# EAGLE design digital (EAGLE 6.6.0)

## Sheet 1 of 5: FPGA
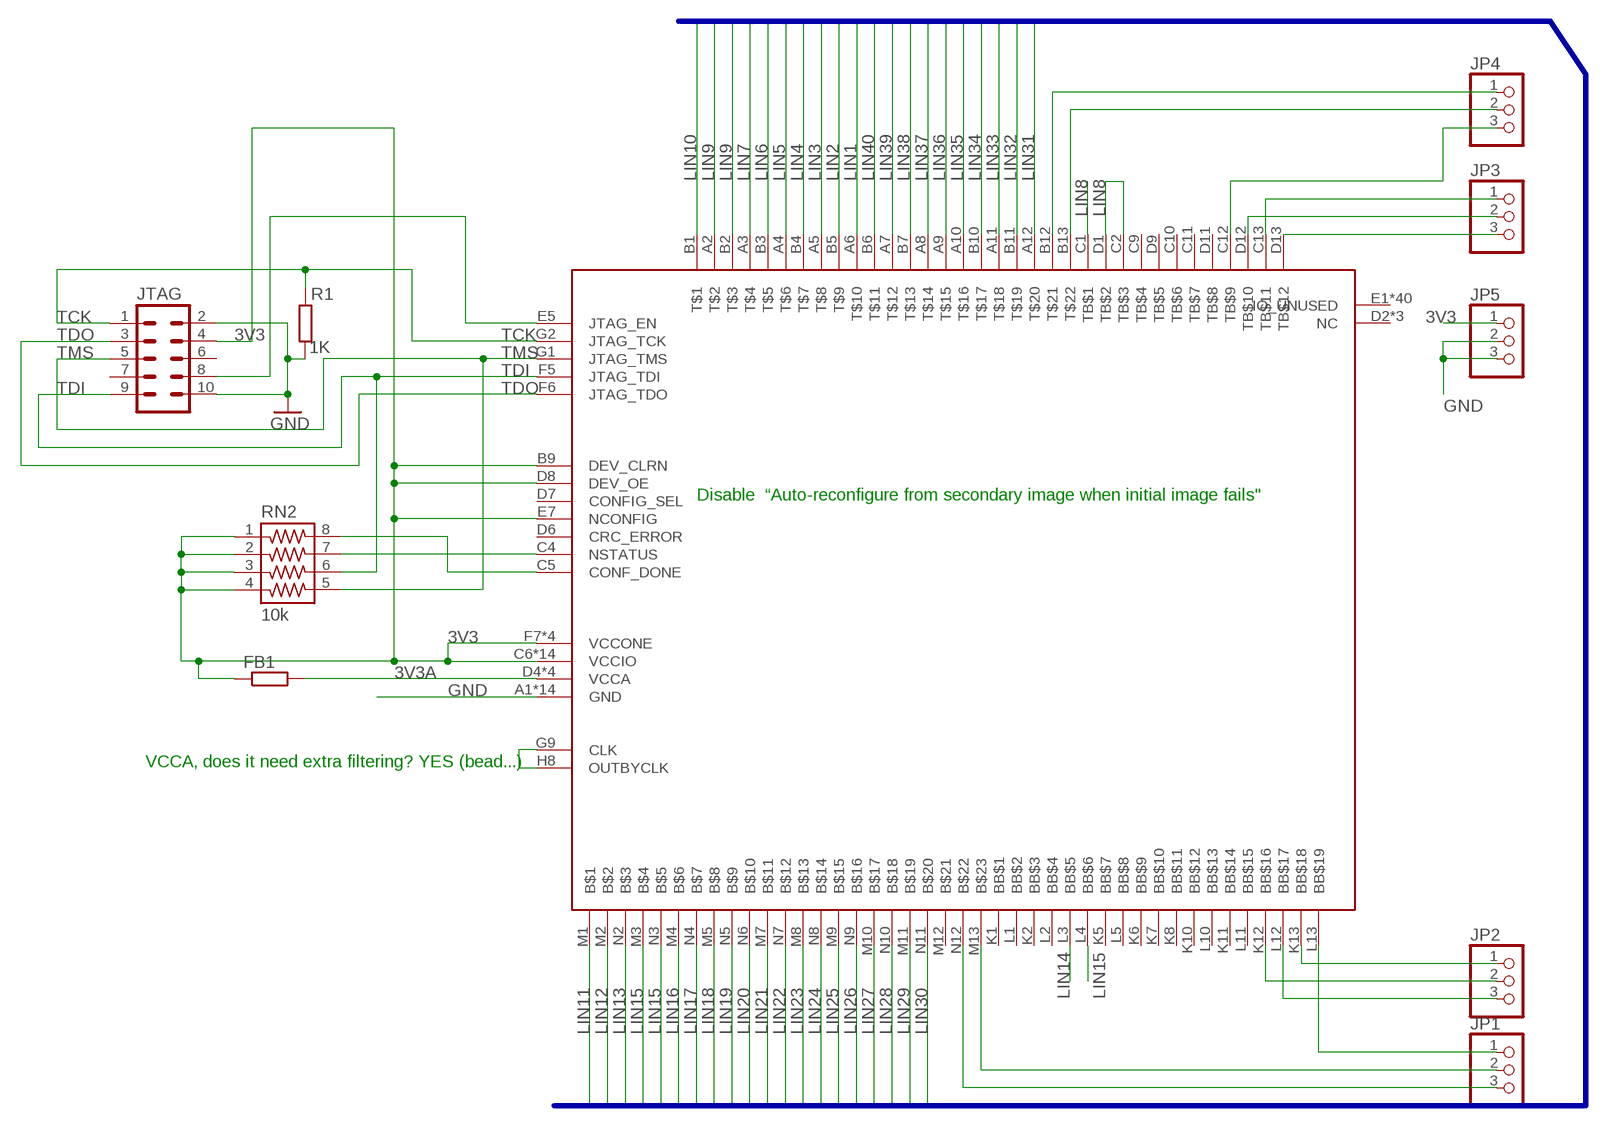
[diagram p0: schematic, sheet 1]

### Parts
FB1  R-EU_R0603  [R0603]
JP1  PINHD-1X3  [1X03]
JP2  PINHD-1X3  [1X03]
JP3  PINHD-1X3  [1X03]
JP4  PINHD-1X3  [1X03]
JP5  PINHD-1X3  [1X03]
JTAG  ML10  [ML10]
MAX10  MAX10  [U169SMALL]
R1  1K  R-EU_R0603  [R0603]
RN2  10k  742-8  [742-8]

### Nets
3V3: FB1.1 JP5.1 JTAG.4 MAX10.B9(DEV_CLRN) MAX10.C6(VCCIO) MAX10.C7(VCCIO) MAX10.C8(VCCIO) MAX10.D8(DEV_OE) MAX10.E7(NCONFIG) MAX10.F2(VCCIO) MAX10.F7(VCCONE) MAX10.F11(VCCIO) MAX10.G3(VCCIO) MAX10.G6(VCCONE) MAX10.G8(VCCONE) MAX10.G11(VCCIO) MAX10.H7(VCCONE) MAX10.H11(VCCIO) MAX10.J3(VCCIO) MAX10.J11(VCCIO) MAX10.K3(VCCIO) MAX10.L6(VCCIO) MAX10.L7(VCCIO) MAX10.L8(VCCIO) RN2.1 RN2.2 RN2.3 RN2.4 ; also sheet 3,5
3V3A: FB1.2 MAX10.D4(VCCA) MAX10.D10(VCCA) MAX10.K4(VCCA) MAX10.K9(VCCA) ; also sheet 5
CONF_DONE: MAX10.C5(CONF_DONE) RN2.8
FAKE_CLK: MAX10.G9(CLK) MAX10.H8(OUTBYCLK)
GND: JP5.2 JP5.3 JTAG.2 JTAG.10 MAX10.A1(GND) MAX10.A13(GND) MAX10.B8(GND) MAX10.C3(GND) MAX10.D5(GND) MAX10.E11(GND) MAX10.F3(GND) MAX10.G7(GND) MAX10.H12(GND) MAX10.J4(GND) MAX10.L9(GND) MAX10.M6(GND) MAX10.N1(GND) MAX10.N13(GND) R1.2 ; also sheet 2,3,4,5
JTAGEN: JTAG.8 MAX10.E5(JTAG_EN)
LIN1: MAX10.A6(T$10) ; also sheet 2
LIN2: MAX10.B5(T$9) ; also sheet 2
LIN3: MAX10.A5(T$8) ; also sheet 2
LIN4: MAX10.B4(T$7) ; also sheet 2
LIN5: MAX10.A4(T$6) ; also sheet 2
LIN6: MAX10.B3(T$5) ; also sheet 2
LIN7: MAX10.A3(T$4) ; also sheet 2
LIN8: MAX10.C1(TB$1) MAX10.C2(TB$3) MAX10.D1(TB$2) ; also sheet 2
LIN9: MAX10.A2(T$2) MAX10.B2(T$3) ; also sheet 2
LIN10: MAX10.B1(T$1) ; also sheet 2
LIN11: MAX10.M1(B$1) ; also sheet 2
LIN12: MAX10.M2(B$2) ; also sheet 2
LIN13: MAX10.N2(B$3) ; also sheet 2
LIN14: MAX10.L3(BB$5) ; also sheet 2
LIN15: MAX10.L4(BB$6) MAX10.M3(B$4) MAX10.N3(B$5) ; also sheet 2
LIN16: MAX10.M4(B$6) ; also sheet 2
LIN17: MAX10.N4(B$7) ; also sheet 2
LIN18: MAX10.M5(B$8) ; also sheet 2
LIN19: MAX10.N5(B$9) ; also sheet 2
LIN20: MAX10.N6(B$10) ; also sheet 2
LIN21: MAX10.M7(B$11) ; also sheet 2
LIN22: MAX10.N7(B$12) ; also sheet 2
LIN23: MAX10.M8(B$13) ; also sheet 2
LIN24: MAX10.N8(B$14) ; also sheet 2
LIN25: MAX10.M9(B$15) ; also sheet 2
LIN26: MAX10.N9(B$16) ; also sheet 2
LIN27: MAX10.M10(B$17) ; also sheet 2
LIN28: MAX10.N10(B$18) ; also sheet 2
LIN29: MAX10.M11(B$19) ; also sheet 2
LIN30: MAX10.N11(B$20) ; also sheet 2
LIN31: MAX10.A12(T$20) ; also sheet 2
LIN32: MAX10.B11(T$19) ; also sheet 2
LIN33: MAX10.A11(T$18) ; also sheet 2
LIN34: MAX10.B10(T$17) ; also sheet 2
LIN35: MAX10.A10(T$16) ; also sheet 2
LIN36: MAX10.A9(T$15) ; also sheet 2
LIN37: MAX10.A8(T$14) ; also sheet 2
LIN38: MAX10.B7(T$13) ; also sheet 2
LIN39: MAX10.A7(T$12) ; also sheet 2
LIN40: MAX10.B6(T$11) ; also sheet 2
N$1: JP2.2 MAX10.K12(BB$16)
N$2: JP1.3 MAX10.N12(B$22)
N$3: JP1.2 MAX10.M13(B$23)
N$4: JP2.1 MAX10.K13(BB$18)
N$5: JP2.3 MAX10.L12(BB$17)
N$6: JP1.1 MAX10.L13(BB$19)
N$8: JP3.3 MAX10.D13(TB$12)
N$9: JP3.1 MAX10.C13(TB$11)
N$10: JP3.2 MAX10.D12(TB$10)
N$11: JP4.3 MAX10.C12(TB$9)
N$15: JP4.2 MAX10.B13(T$22)
N$16: JP4.1 MAX10.B12(T$21)
NSTATUS: MAX10.C4(NSTATUS) RN2.7
TCK: JTAG.1 MAX10.G2(JTAG_TCK) R1.1
TDI: JTAG.9 MAX10.F5(JTAG_TDI) RN2.6
TDO: JTAG.3 MAX10.F6(JTAG_TDO)
TMS: JTAG.5 MAX10.G1(JTAG_TMS) RN2.5
Unconnected: JTAG.6 JTAG.7 MAX10.C9(TB$4) MAX10.C10(TB$6) MAX10.C11(TB$7) MAX10.D2(NC) MAX10.D3(NC) MAX10.D6(CRC_ERROR) MAX10.D7(CONFIG_SEL) MAX10.D9(TB$5) MAX10.D11(TB$8) MAX10.E1(IO_UNUSED) MAX10.E2(NC) MAX10.E3(IO_UNUSED) MAX10.E4(IO_UNUSED) MAX10.E6(IO_UNUSED) MAX10.E8(IO_UNUSED) MAX10.E9(IO_UNUSED) MAX10.E10(IO_UNUSED) MAX10.E12(IO_UNUSED) MAX10.E13(IO_UNUSED) MAX10.F1(IO_UNUSED) MAX10.F4(IO_UNUSED) MAX10.F8(IO_UNUSED) MAX10.F9(IO_UNUSED) MAX10.F10(IO_UNUSED) MAX10.F12(IO_UNUSED) MAX10.F13(IO_UNUSED) MAX10.G4(IO_UNUSED) MAX10.G5(IO_UNUSED) MAX10.G10(IO_UNUSED) MAX10.G12(IO_UNUSED) MAX10.G13(IO_UNUSED) MAX10.H1(IO_UNUSED) MAX10.H2(IO_UNUSED) MAX10.H3(IO_UNUSED) MAX10.H4(IO_UNUSED) MAX10.H5(IO_UNUSED) MAX10.H6(IO_UNUSED) MAX10.H9(IO_UNUSED) MAX10.H10(IO_UNUSED) MAX10.H13(IO_UNUSED) MAX10.J1(IO_UNUSED) MAX10.J2(IO_UNUSED) MAX10.J5(IO_UNUSED) MAX10.J6(IO_UNUSED) MAX10.J7(IO_UNUSED) MAX10.J8(IO_UNUSED) MAX10.J9(IO_UNUSED) MAX10.J10(IO_UNUSED) MAX10.J12(IO_UNUSED) MAX10.J13(IO_UNUSED) MAX10.K1(BB$1) MAX10.K2(BB$3) MAX10.K5(BB$7) MAX10.K6(BB$9) MAX10.K7(BB$10) MAX10.K8(BB$11) MAX10.K10(BB$12) MAX10.K11(BB$14) MAX10.L1(BB$2) MAX10.L2(BB$4) MAX10.L5(BB$8) MAX10.L10(BB$13) MAX10.L11(BB$15) MAX10.M12(B$21)

### Buses
LIN[1..40]

### Notes on the sheet
- Disable  “Auto-reconfigure from secondary image when initial image fails"
- VCCA, does it need extra filtering? YES (bead...)

## Sheet 2 of 5: Level conv
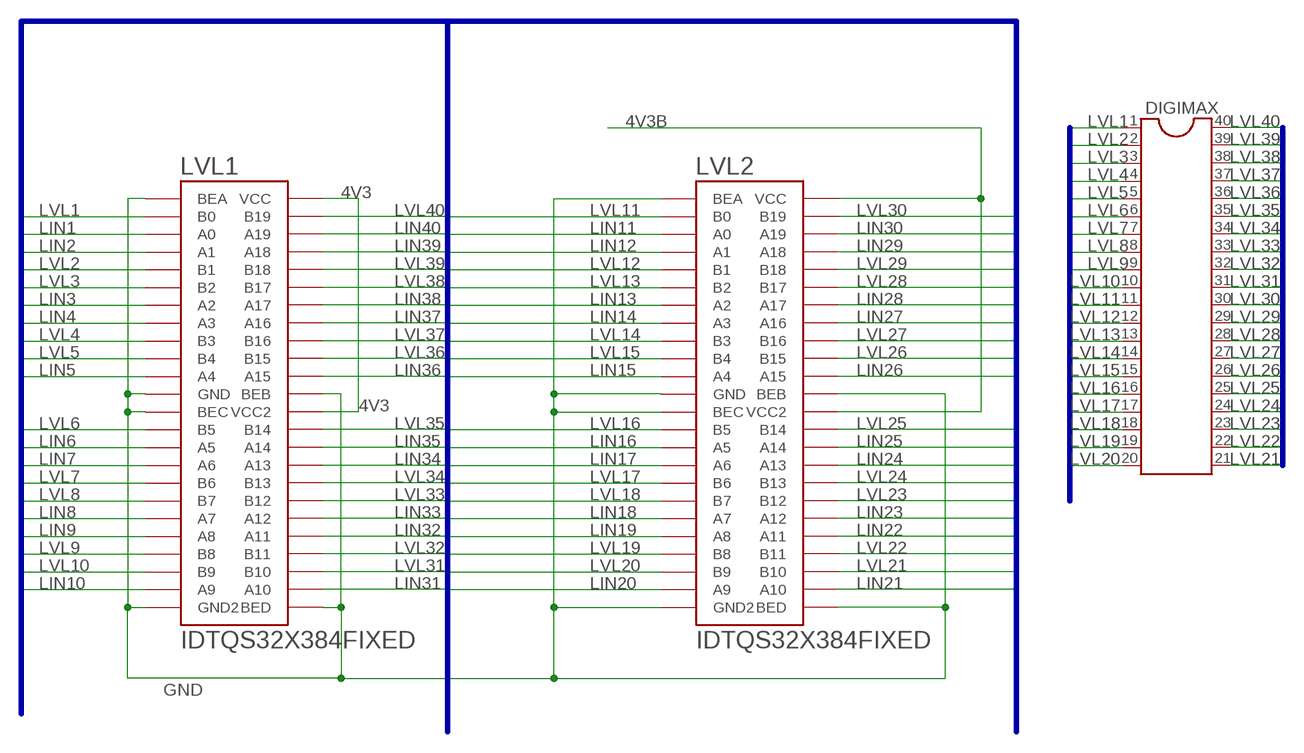
[diagram p1: schematic, sheet 2]

### Parts
DIGIMAX  DIL40  [DIL40]
LVL1  IDTQS32X384FIXED  [IDTQS32X384_04MM]
LVL2  IDTQS32X384FIXED  [IDTQS32X384_04MM]

### Nets
4V3: LVL1.P$36(VCC2) LVL1.P$48(VCC) ; also sheet 4
4V3B: LVL2.P$36(VCC2) LVL2.P$48(VCC) ; also sheet 4
GND: LVL1.P$1(BEA) LVL1.P$12(GND) LVL1.P$13(BEC) LVL1.P$24(GND2) LVL1.P$25(BED) LVL1.P$37(BEB) LVL2.P$1(BEA) LVL2.P$12(GND) LVL2.P$13(BEC) LVL2.P$24(GND2) LVL2.P$25(BED) LVL2.P$37(BEB) ; also sheet 1,3,4,5
LIN1: LVL1.P$3(A0) ; also sheet 1
LIN2: LVL1.P$4(A1) ; also sheet 1
LIN3: LVL1.P$7(A2) ; also sheet 1
LIN4: LVL1.P$8(A3) ; also sheet 1
LIN5: LVL1.P$11(A4) ; also sheet 1
LIN6: LVL1.P$15(A5) ; also sheet 1
LIN7: LVL1.P$16(A6) ; also sheet 1
LIN8: LVL1.P$19(A7) ; also sheet 1
LIN9: LVL1.P$20(A8) ; also sheet 1
LIN10: LVL1.P$23(A9) ; also sheet 1
LIN11: LVL2.P$3(A0) ; also sheet 1
LIN12: LVL2.P$4(A1) ; also sheet 1
LIN13: LVL2.P$7(A2) ; also sheet 1
LIN14: LVL2.P$8(A3) ; also sheet 1
LIN15: LVL2.P$11(A4) ; also sheet 1
LIN16: LVL2.P$15(A5) ; also sheet 1
LIN17: LVL2.P$16(A6) ; also sheet 1
LIN18: LVL2.P$19(A7) ; also sheet 1
LIN19: LVL2.P$20(A8) ; also sheet 1
LIN20: LVL2.P$23(A9) ; also sheet 1
LIN21: LVL2.P$26(A10) ; also sheet 1
LIN22: LVL2.P$29(A11) ; also sheet 1
LIN23: LVL2.P$30(A12) ; also sheet 1
LIN24: LVL2.P$33(A13) ; also sheet 1
LIN25: LVL2.P$34(A14) ; also sheet 1
LIN26: LVL2.P$38(A15) ; also sheet 1
LIN27: LVL2.P$41(A16) ; also sheet 1
LIN28: LVL2.P$42(A17) ; also sheet 1
LIN29: LVL2.P$45(A18) ; also sheet 1
LIN30: LVL2.P$46(A19) ; also sheet 1
LIN31: LVL1.P$26(A10) ; also sheet 1
LIN32: LVL1.P$29(A11) ; also sheet 1
LIN33: LVL1.P$30(A12) ; also sheet 1
LIN34: LVL1.P$33(A13) ; also sheet 1
LIN35: LVL1.P$34(A14) ; also sheet 1
LIN36: LVL1.P$38(A15) ; also sheet 1
LIN37: LVL1.P$41(A16) ; also sheet 1
LIN38: LVL1.P$42(A17) ; also sheet 1
LIN39: LVL1.P$45(A18) ; also sheet 1
LIN40: LVL1.P$46(A19) ; also sheet 1
LVL1: DIGIMAX.1 LVL1.P$2(B0)
LVL2: DIGIMAX.2 LVL1.P$5(B1)
LVL3: DIGIMAX.3 LVL1.P$6(B2)
LVL4: DIGIMAX.4 LVL1.P$9(B3)
LVL5: DIGIMAX.5 LVL1.P$10(B4)
LVL6: DIGIMAX.6 LVL1.P$14(B5)
LVL7: DIGIMAX.7 LVL1.P$17(B6)
LVL8: DIGIMAX.8 LVL1.P$18(B7)
LVL9: DIGIMAX.9 LVL1.P$21(B8)
LVL10: DIGIMAX.10 LVL1.P$22(B9)
LVL11: DIGIMAX.11 LVL2.P$2(B0)
LVL12: DIGIMAX.12 LVL2.P$5(B1)
LVL13: DIGIMAX.13 LVL2.P$6(B2)
LVL14: DIGIMAX.14 LVL2.P$9(B3)
LVL15: DIGIMAX.15 LVL2.P$10(B4)
LVL16: DIGIMAX.16 LVL2.P$14(B5)
LVL17: DIGIMAX.17 LVL2.P$17(B6)
LVL18: DIGIMAX.18 LVL2.P$18(B7)
LVL19: DIGIMAX.19 LVL2.P$21(B8)
LVL20: DIGIMAX.20 LVL2.P$22(B9)
LVL21: DIGIMAX.21 LVL2.P$27(B10)
LVL22: DIGIMAX.22 LVL2.P$28(B11)
LVL23: DIGIMAX.23 LVL2.P$31(B12)
LVL24: DIGIMAX.24 LVL2.P$32(B13)
LVL25: DIGIMAX.25 LVL2.P$35(B14)
LVL26: DIGIMAX.26 LVL2.P$39(B15)
LVL27: DIGIMAX.27 LVL2.P$40(B16)
LVL28: DIGIMAX.28 LVL2.P$43(B17)
LVL29: DIGIMAX.29 LVL2.P$44(B18)
LVL30: DIGIMAX.30 LVL2.P$47(B19)
LVL31: DIGIMAX.31 LVL1.P$27(B10)
LVL32: DIGIMAX.32 LVL1.P$28(B11)
LVL33: DIGIMAX.33 LVL1.P$31(B12)
LVL34: DIGIMAX.34 LVL1.P$32(B13)
LVL35: DIGIMAX.35 LVL1.P$35(B14)
LVL36: DIGIMAX.36 LVL1.P$39(B15)
LVL37: DIGIMAX.37 LVL1.P$40(B16)
LVL38: DIGIMAX.38 LVL1.P$43(B17)
LVL39: DIGIMAX.39 LVL1.P$44(B18)
LVL40: DIGIMAX.40 LVL1.P$47(B19)

### Buses
LIN[1..40],LVL[1..40]
LVL[1..40]

## Sheet 3 of 5: Power regs
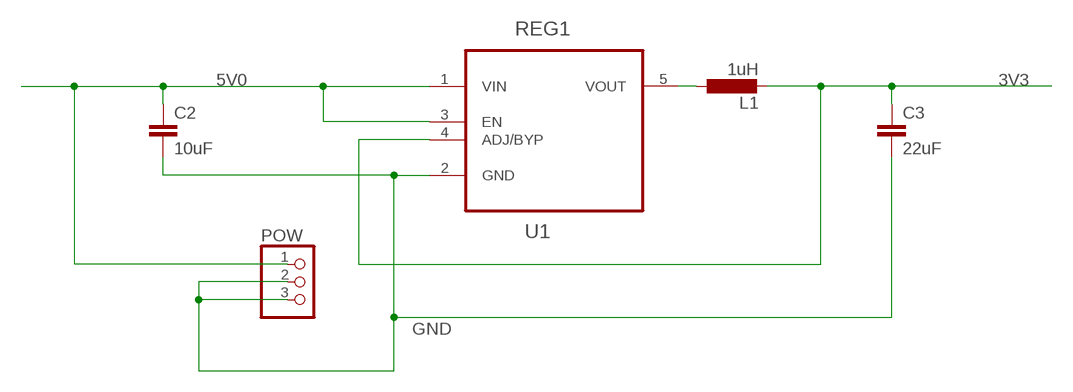
[diagram p2: schematic, sheet 3]

### Parts
C2  10uF  C-EUC0805  [C0805]
C3  22uF  C-EUC0805  [C0805]
L1  1uH  L-EUL3225M  [L3225M]
POW  PINHD-1X3  [1X03]
REG1  U1  SPX3819M5-L-5-0  [SOT95P280X145-5N]

### Nets
3V3: C3.1 L1.2 REG1.4(ADJ/BYP) ; also sheet 1,5
5V0: C2.1 POW.1 REG1.1(VIN) REG1.3(EN) ; also sheet 4
GND: C2.2 C3.2 POW.2 POW.3 REG1.2(GND) ; also sheet 1,2,4,5
N$137: L1.1 REG1.5(VOUT)

## Sheet 4 of 5: Level conv power
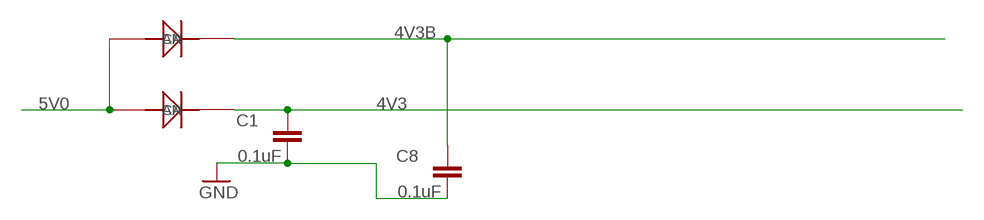
[diagram p3: schematic, sheet 4]

### Parts
C1  0.1uF  C-EUC0603  [C0603]
C8  0.1uF  C-EUC0603  [C0603]
D1  1N4148  [SOD123]
D2  1N4148  [SOD123]

### Nets
4V3: C1.2 D1.1(CA) ; also sheet 2
4V3B: C8.2 D2.1(CA) ; also sheet 2
5V0: D1.2(AN) D2.2(AN) ; also sheet 3
GND: C1.1 C8.1 ; also sheet 1,2,3,5

## Sheet 5 of 5: Decoupling
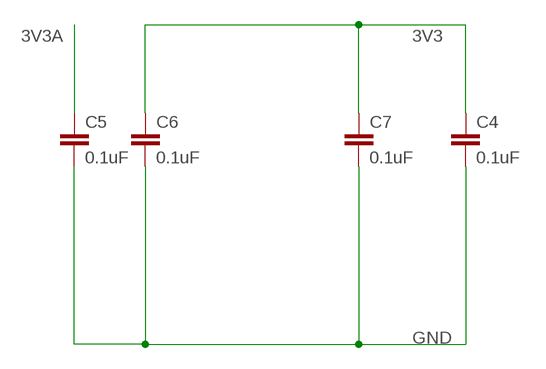
[diagram p4: schematic, sheet 5]

### Parts
C4  0.1uF  C-EUC0603  [C0603]
C5  0.1uF  C-EUC0603  [C0603]
C6  0.1uF  C-EUC0603  [C0603]
C7  0.1uF  C-EUC0603  [C0603]

### Nets
3V3: C4.1 C6.1 C7.1 ; also sheet 1,3
3V3A: C5.1 ; also sheet 1
GND: C4.2 C5.2 C6.2 C7.2 ; also sheet 1,2,3,4

## Library data of the parts
C1 C8 = resistor:C-EU: CAPACITOR, European symbol
C2-C7 = rcl:C-EU: CAPACITOR, European symbol
D1 D2 = quickswitch:1N4148
DIGIMAX = ic-package:DIL40: Dual In Line
FB1 R1 = rcl:R-EU_: RESISTOR, European symbol
JP1-JP5 POW = max10:PINHD-1X3: PIN HEADER
JTAG = con-ml:ML10: HARTING; OC_FARNELL: unknown; OC_NEWARK: unknown
L1 = rcl:L-EU: INDUCTOR, European symbol
LVL1 LVL2 = IDT:IDTQS32X384
MAX10 = max10:MAX10
REG1 = Exar_By_element14_Batch_1:SPX3819M5-L-5-0: 500mA, LOW-NOISE LDO VOLTAGE REGULATOR; MPN: SPX3819M5-L-5-0; OC_FARNELL: 1829408; OC_NEWARK: 84R4417; PACKAGE: SOT-23-5; SUPPLIER: EXAR
RN2 = resistor-array:742-8: CTS 742 Series 8 Terminations, 4 Resistors

## Board
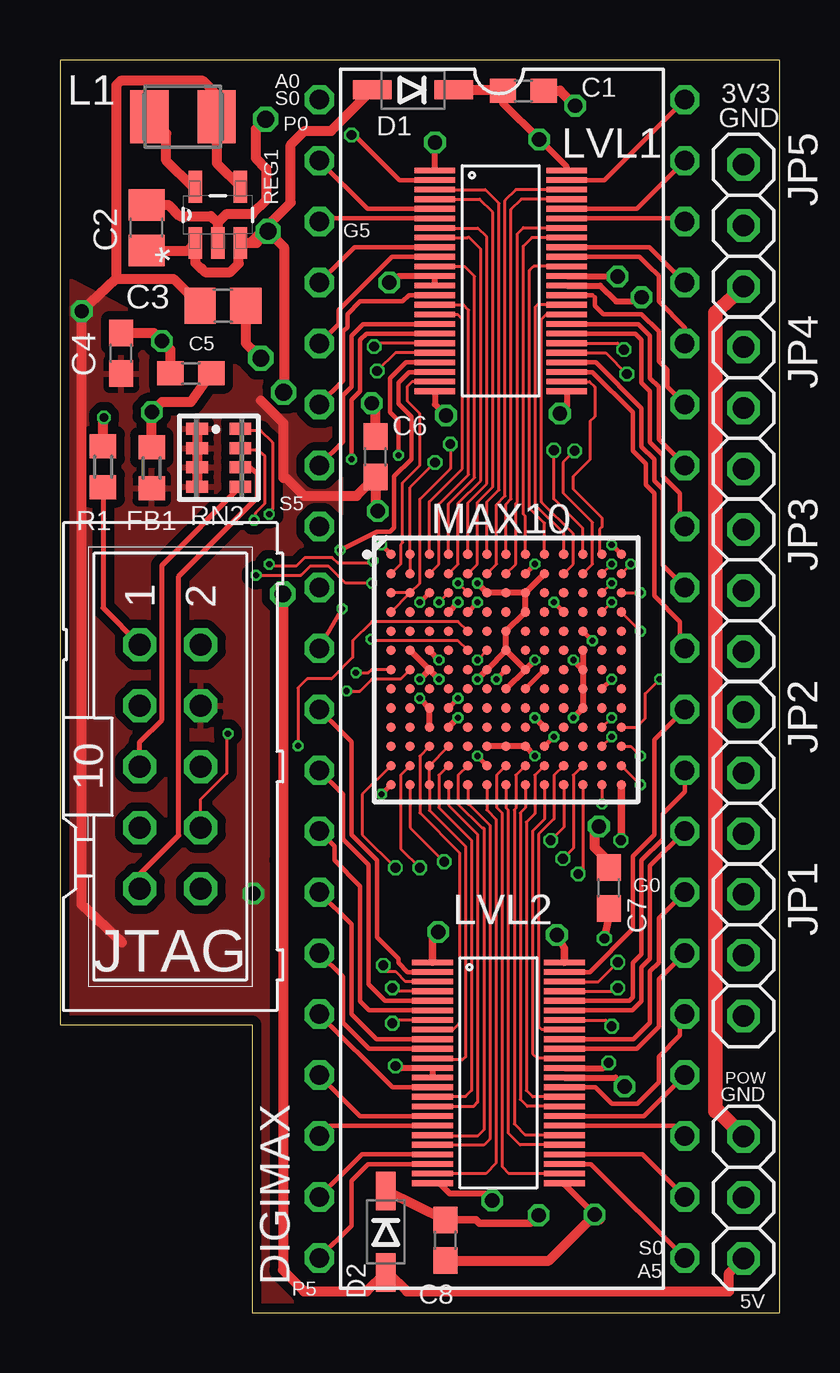
[diagram p5: board, top side]
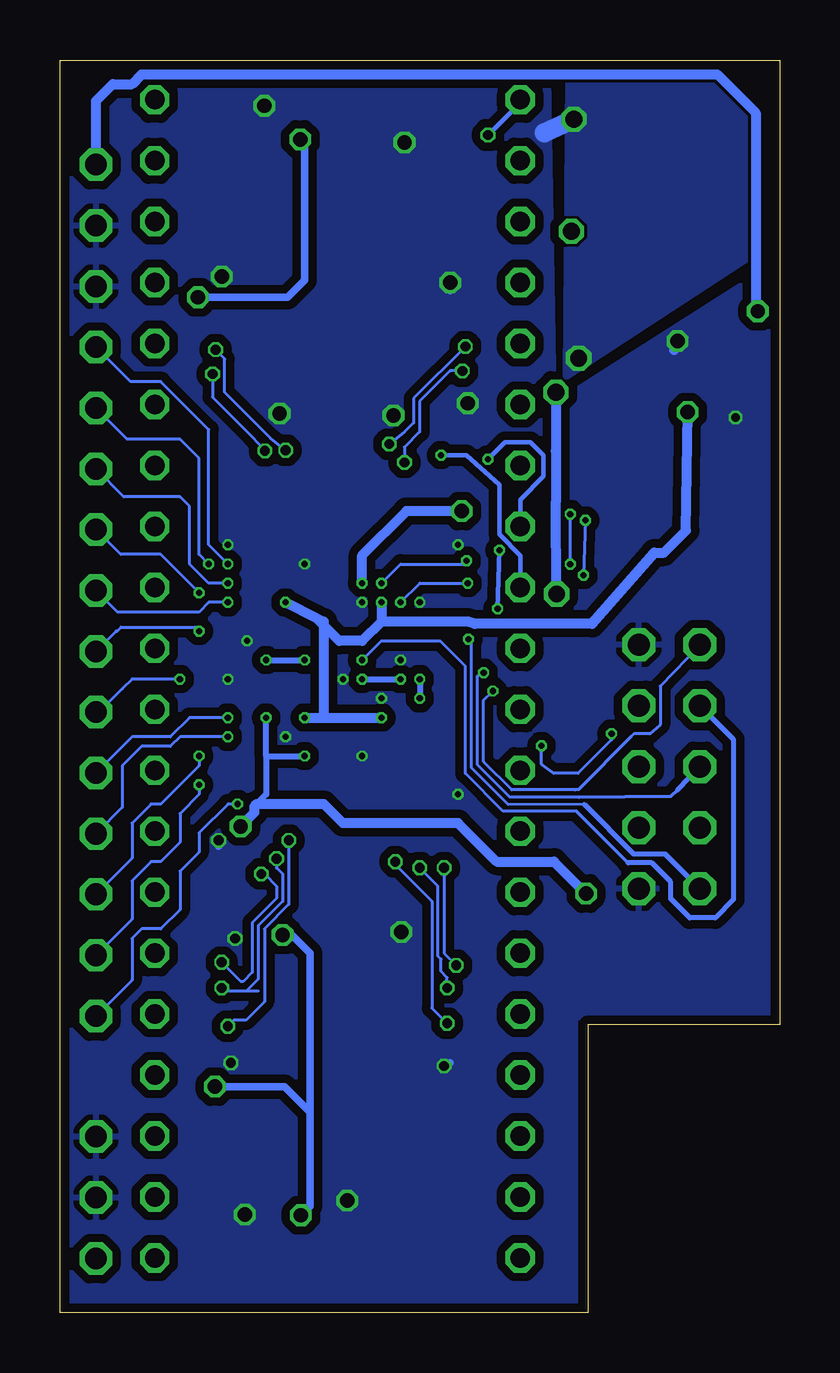
[diagram p6: board, bottom side, seen from below]

Size 30 x 52.2 mm. Coordinates in mm from the lower left corner, seen from the top.
Outline: 30,52.2 0,52.2 0,12 8,12 8,0 30,0 30,52.2
Copper layers (1*16): Top 0.035559375mm / dielectric 0.17018125mm / Bottom 0.035559375mm
Design rules "OSHPark-4layer_as2layer *": minimum track width 5mil, minimum drill 10mil, track to track 5mil, track to pad 5mil, pad to pad 5mil, via to via 5mil, smd to smd 5mil, copper to edge 15mil, drill to drill 6mil, minimum pad ring 4mil, minimum via ring 4mil, stop-mask expansion 4mil, vias tented up to drill 15mil, thermal gap 10mil

### Footprints (pad centres in the part's own frame; a part is rotated, then mirrored left to right if it is on the bottom)
C0603 = smd 1.1 x 1: 1 -0.85,0; 2 0.85,0
C0805 = smd 1.3 x 1.5: 1 -0.95,0; 2 0.95,0
SOD123 = smd 1.6 x 0.8: 1 -1.7,0; 2 1.7,0
DIL40 = drill 0.813 octagon: 1 -24.13,-7.62; 2 -21.59,-7.62; 3 -19.05,-7.62; 4 -16.51,-7.62; 5 -13.97,-7.62; 6 -11.43,-7.62; 7 -8.89,-7.62; 8 -6.35,-7.62; 9 -3.81,-7.62; 10 -1.27,-7.62; 11 1.27,-7.62; 12 3.81,-7.62; 13 6.35,-7.62; 14 8.89,-7.62; 15 11.43,-7.62; 16 13.97,-7.62; 17 16.51,-7.62; 18 19.05,-7.62; 19 21.59,-7.62; 20 24.13,-7.62; 21 24.13,7.62; 22 21.59,7.62; 23 19.05,7.62; 24 16.51,7.62; 25 13.97,7.62; 26 11.43,7.62; 27 8.89,7.62; 28 6.35,7.62; 29 3.81,7.62; 30 1.27,7.62; 31 -1.27,7.62; 32 -3.81,7.62; 33 -6.35,7.62; 34 -8.89,7.62; 35 -11.43,7.62; 36 -13.97,7.62; 37 -16.51,7.62; 38 -19.05,7.62; 39 -21.59,7.62; 40 -24.13,7.62
R0603 = smd 1 x 1.1: 1 -0.85,0; 2 0.85,0
1X03 = drill 0.9 octagon: 1 -2.54,0; 2 0,0; 3 2.54,0
ML10 = drill 0.914 octagon: 1 -5.08,-1.27; 2 -5.08,1.27; 3 -2.54,-1.27; 4 -2.54,1.27; 5 0,-1.27; 6 0,1.27; 7 2.54,-1.27; 8 2.54,1.27; 9 5.08,-1.27; 10 5.08,1.27
L3225M = smd 1.6 x 2.2: 1 -1.4,0; 2 1.4,0
IDTQS32X384_04MM = smd 0.24 x 1.7: P$1 -4.6,-2.51; P$2 -4.2,-2.51; P$3 -3.8,-2.51; P$4 -3.4,-2.51; P$5 -3,-2.51; P$6 -2.6,-2.51; P$7 -2.2,-2.51; P$8 -1.8,-2.51; P$9 -1.4,-2.51; P$10 -1,-2.51; P$11 -0.6,-2.51; P$12 -0.2,-2.51; P$13 0.2,-2.51; P$14 0.6,-2.51; P$15 1,-2.51; P$16 1.4,-2.51; P$17 1.8,-2.51; P$18 2.2,-2.51; P$19 2.6,-2.51; P$20 3,-2.51; P$21 3.4,-2.51; P$22 3.8,-2.51; P$23 4.2,-2.51; P$24 4.6,-2.51; P$25 4.6,2.99; P$26 4.2,2.99; P$27 3.8,2.99; P$28 3.4,2.99; P$29 3,2.99; P$30 2.6,2.99; P$31 2.2,2.99; P$32 1.8,2.99; P$33 1.4,2.99; P$34 1,2.99; P$35 0.6,2.99; P$36 0.2,2.99; P$37 -0.2,2.99; P$38 -0.6,2.99; P$39 -1,2.99; P$40 -1.4,2.99; P$41 -1.8,2.99; P$42 -2.2,2.99; P$43 -2.6,2.99; P$44 -3,2.99; P$45 -3.4,2.99; P$46 -3.8,2.99; P$47 -4.2,2.99; P$48 -4.6,2.99
U169SMALL = smd 0.4 x 0.4: A1 -4.8,4.8; A2 -4,4.8; A3 -3.2,4.8; A4 -2.4,4.8; A5 -1.6,4.8; A6 -0.8,4.8; A7 0,4.8; A8 0.8,4.8; A9 1.6,4.8; A10 2.4,4.8; A11 3.2,4.8; A12 4,4.8; A13 4.8,4.8; B1 -4.8,4; B2 -4,4; B3 -3.2,4; B4 -2.4,4; B5 -1.6,4; B6 -0.8,4; B7 0,4; B8 0.8,4; B9 1.6,4; B10 2.4,4; B11 3.2,4; B12 4,4; B13 4.8,4; C1 -4.8,3.2; C2 -4,3.2; C3 -3.2,3.2; C4 -2.4,3.2; C5 -1.6,3.2; C6 -0.8,3.2; C7 0,3.2; C8 0.8,3.2; C9 1.6,3.2; C10 2.4,3.2; C11 3.2,3.2; C12 4,3.2; C13 4.8,3.2; D1 -4.8,2.4; D2 -4,2.4; D3 -3.2,2.4; D4 -2.4,2.4; D5 -1.6,2.4; D6 -0.8,2.4; D7 0,2.4; D8 0.8,2.4; D9 1.6,2.4; D10 2.4,2.4; D11 3.2,2.4; D12 4,2.4; D13 4.8,2.4; E1 -4.8,1.6; E2 -4,1.6; E3 -3.2,1.6; E4 -2.4,1.6; E5 -1.6,1.6; E6 -0.8,1.6; E7 0,1.6; E8 0.8,1.6; E9 1.6,1.6; E10 2.4,1.6; E11 3.2,1.6; E12 4,1.6; E13 4.8,1.6; F1 -4.8,0.8; F2 -4,0.8; F3 -3.2,0.8; F4 -2.4,0.8; F5 -1.6,0.8; F6 -0.8,0.8; F7 0,0.8; F8 0.8,0.8; F9 1.6,0.8; F10 2.4,0.8; F11 3.2,0.8; F12 4,0.8; F13 4.8,0.8; G1 -4.8,0; G2 -4,0; G3 -3.2,0; G4 -2.4,0; G5 -1.6,0; G6 -0.8,0; G7 0,0; G8 0.8,0; G9 1.6,0; G10 2.4,0; G11 3.2,0; G12 4,0; G13 4.8,0; H1 -4.8,-0.8; H2 -4,-0.8; H3 -3.2,-0.8; H4 -2.4,-0.8; H5 -1.6,-0.8; H6 -0.8,-0.8; H7 0,-0.8; H8 0.8,-0.8; H9 1.6,-0.8; H10 2.4,-0.8; H11 3.2,-0.8; H12 4,-0.8; H13 4.8,-0.8; J1 -4.8,-1.6; J2 -4,-1.6; J3 -3.2,-1.6; J4 -2.4,-1.6; J5 -1.6,-1.6; J6 -0.8,-1.6; J7 0,-1.6; J8 0.8,-1.6; J9 1.6,-1.6; J10 2.4,-1.6; J11 3.2,-1.6; J12 4,-1.6; J13 4.8,-1.6; K1 -4.8,-2.4; K2 -4,-2.4; K3 -3.2,-2.4; K4 -2.4,-2.4; K5 -1.6,-2.4; K6 -0.8,-2.4; K7 0,-2.4; K8 0.8,-2.4; K9 1.6,-2.4; K10 2.4,-2.4; K11 3.2,-2.4; K12 4,-2.4; K13 4.8,-2.4; L1 -4.8,-3.2; L2 -4,-3.2; L3 -3.2,-3.2; L4 -2.4,-3.2; L5 -1.6,-3.2; L6 -0.8,-3.2; L7 0,-3.2; L8 0.8,-3.2; L9 1.6,-3.2; L10 2.4,-3.2; L11 3.2,-3.2; L12 4,-3.2; L13 4.8,-3.2; M1 -4.8,-4; M2 -4,-4; M3 -3.2,-4; M4 -2.4,-4; M5 -1.6,-4; M6 -0.8,-4; M7 0,-4; M8 0.8,-4; M9 1.6,-4; M10 2.4,-4; M11 3.2,-4; M12 4,-4; M13 4.8,-4; N1 -4.8,-4.8; N2 -4,-4.8; N3 -3.2,-4.8; N4 -2.4,-4.8; N5 -1.6,-4.8; N6 -0.8,-4.8; N7 0,-4.8; N8 0.8,-4.8; N9 1.6,-4.8; N10 2.4,-4.8; N11 3.2,-4.8; N12 4,-4.8; N13 4.8,-4.8
SOT95P280X145-5N = smd 1.321 x 0.559: 1 -1.168,0.94; 2 -1.168,0; 3 -1.168,-0.94; 4 1.168,-0.94; 5 1.168,0.94
742-8 = smd 0.5 x 0.9: 1 -1.2,-0.9; 2 -0.4,-0.9; 3 0.4,-0.9; 4 1.2,-0.9; 5 1.2,0.9; 6 0.4,0.9; 7 -0.4,0.9; 8 -1.2,0.9

### Placement (x,y rotation side)
C1  19.32,50.92 180 top
C2  3.61,45.21 90 top
C3  6.8,41.96 0 top
C4  2.55,39.98 90 top
C5  5.46,39.15 180 top
C6  13.15,35.67 90 top
C7  22.88,17.7 270 top
C8  16.07,3.02 90 top
D1  14.72,50.96 180 top
D2  13.58,3.38 270 top
DIGIMAX  18.43,26.42 270 top
FB1  3.83,35.2 90 top
JP1  28.5,14.9 270 top
JP2  28.5,22.5 270 top
JP3  28.5,30.1 270 top
JP4  28.5,37.7 270 top
JP5  28.5,45.3 270 top
JTAG  4.6,22.76 270 top
L1  5.13,49.83 0 top
LVL1  18.14,43 270 top
LVL2  18.04,10 270 top
MAX10  18.6,26.8 0 top
POW  28.5,4.8 90 top
R1  1.79,35.26 90 top
REG1  6.58,45.75 90 top
RN2  6.62,35.63 270 top

### Tracks (layer width: path | path; a pad name or v marks a point on that pad's centre or on a via)
3V3  (via drill 0.25, 0.6)
  Top 0.178: MAX10.L8 19.49,23.6
  Top 0.254: MAX10.F11 MAX10.G11 | MAX10.G11 MAX10.H11 MAX10.J11 v21.4,24.8 | MAX10.F7 MAX10.G8 | MAX10.G8 MAX10.H7 | MAX10.K3 MAX10.J3 v15,25.6 | MAX10.L6 MAX10.L7 MAX10.L8 v19.8,23.2 | MAX10.G3 MAX10.F2 | MAX10.F7 MAX10.E7 MAX10.D8 MAX10.C8 | MAX10.C8 MAX10.B9 | MAX10.C8 MAX10.C7 MAX10.C6 v17.4,30.4 | v17.4,26.4 MAX10.G6 MAX10.F7 | MAX10.G8 v19.8,27.2 | MAX10.G11 v21.4,27.2 | v15.8,26.4 MAX10.G3 | v15,26.4 MAX10.G3
  Top 0.406: 2.35,43.08 2.35,51.16 2.53,51.33 5.96,51.33 6.53,50.76 L1.2 6.53,47.91 REG1.4 | 5.87,41.59 C3.1 4.73,43.08 2.35,43.08 | 2.58,15.44 0.91,17.02 v0.91,41.73 2.35,43.08 | RN2.1 RN2.2 RN2.3 RN2.4 | 8.38,38.01 9.32,37.07 9.32,34.79 9.42,34.79 10.18,34.04 12.37,34.04 C6.1 13.15,33.47 v13.25,33.4 | C7.1 22.88,18.8 22.29,19.38 22.29,20.09 v22.47,20.27
  Bottom 0.254: v21.4,27.2 v19.8,27.2 | v17.4,26.4 v15.8,26.4 | v15,26.4 v15,25.6 | 21.4,23.2 v19.8,23.2 | 21.4,23.2 21.4,21.6 21.9,21.1 | 21.4,23.2 v21.4,24.8
  Bottom 0.406: v21.4,27.2 v21.41,27.2 v21.41,27.19 | v13.25,33.4 15.56,33.4 17.4,31.56 v17.4,30.4 | v8.07,17.47 9.4,18.8 11.8,18.8 13.4,20.4 18.2,20.4 19,21.2 21.8,21.2 21.9,21.1 21.9,20.84 v22.47,20.27 | JP5.1 28.5,50.5 27.8,51.2 27,51.2 26.6,51.6 2.6,51.6 1,50 1,41.83 v0.91,41.73
  pour Top (isolate 0.356, rank 6): 0.65,42.9 9.62,38.23 9.95,38.23 9.95,51.31 11.7,51.31 11.7,0.1 8.4,0.1 8.4,12.19 0.45,12.19 0.45,43
3V3A  (via drill 0.25, 0.6)
  Top 0.178: MAX10.D10 v20.6,29.6
  Top 0.254: MAX10.K9 v19.8,24.8 | v16.6,24.8 MAX10.K4 | MAX10.D4 v16.6,29.6
  Top 0.406: C5.1 5.45,37.95 4.25,37.95 v3.83,37.53 FB1.2
  Bottom 0.406: v3.83,37.53 3.9,32.59 4.82,31.67 5.22,31.67 7.81,28.7 12.72,28.7 13,28.8 16.6,28.8 | v19.8,24.8 19,24.8 | 19,24.8 v16.6,24.8 | v20.6,29.6 19.32,28.96 | 19.32,28.96 19,28.8 19,24.8 | v16.6,29.6 16.6,28.8 | 19.32,28.96 18.36,28 17.4,28 16.6,28.8
4V3  (via drill 0.6)
  Top 0.254: LVL1.P$36 22.52,42.8 23.18,42.14 24.07,42.14 v24.25,42.32 | LVL1.P$48 21.13,47.75 v19.98,48.9
  Top 0.305: C1.2 18.47,50.41 v19.98,48.9
  Top 0.406: D1.1 18.43,50.96 C1.2
  Bottom 0.305: v24.25,42.32 20.51,42.32 19.8,43.03 19.8,48.72 v19.98,48.9
4V3B  (via drill 0.6)
  Top 0.254: LVL2.P$36 23.16,9.8 v23.54,9.42
  Top 0.305: LVL2.P$48 21.03,15.18 v20.72,15.75 | C8.2 17.35,3.87 17.49,3.73 19.62,3.73 v19.95,4.06
  Top 0.406: D2.1 13.62,5.08 C8.2
  Bottom 0.305: v20.72,15.75 20.34,15.75 19.57,14.99 19.57,8.36 | 19.57,8.36 19.57,4.45 v19.95,4.06 | v23.54,9.42 20.64,9.42 19.57,8.36
5V0  (via drill 0.7)
  Top 0.406: C2.1 5.33,44.26 REG1.1 5.64,43.75 5.88,43.51 5.91,43.51 6.06,43.36 7.1,43.36 7.46,43.71 7.46,44.52 REG1.3 7.94,44.58 | 7.94,44.58 9.62,46.25 9.62,48.67 10.2,49.25 11.31,49.25 D1.2 | 7.94,44.58 8.2,44.58 v8.68,45.06 9.34,44.4 9.34,38.18 v9.32,38.35 | v9.29,29.95 9.29,18.87 9.31,13.69 9.31,1.79 9.29,1.77 10.18,0.89 12.79,0.89 D2.2 13.68,1.68 14.47,0.89 27.89,0.89 27.89,1.65 POW.1
  Bottom 0.406: v9.32,38.35 9.32,38.22 9.33,35.91 9.33,33.77 v9.29,29.95
CONF_DONE  (via drill 0.25)
  Top 0.127: RN2.8 7.43,36.75 8.37,36.75 8.86,36.27 8.86,33.5 v8.73,33.27 | MAX10.C5 v16.6,30.4 | v8.73,31.19 8.96,31.11 9.85,31.11 10.2,31.47 11.34,31.47 11.57,31.24 12.95,31.24 v13.05,31.34
  Bottom 0.127: v8.73,31.19 v8.73,33.27 | v16.6,30.4 15.8,31.2 13.18,31.2 v13.05,31.34
FAKE_CLK
  Top 0.178: MAX10.G9 MAX10.H8
GND  (via drill 0.25, 0.36, 0.41, 0.6, 0.7)
  Top 0.178: MAX10.H12 v23,26.4 | MAX10.E11 v22.2,28 | MAX10.A13 v23,32 | MAX10.B8 v19.8,31.2 | MAX10.L9 v20.6,24 | v17.4,23.2 MAX10.M6 | MAX10.N1 v13.4,21.6 | MAX10.A1 v13.4,32 | MAX10.C3 v15,29.6 | MAX10.G7 v18.2,26.4 | MAX10.J4 v16.6,25.6 | MAX10.D5 v17.4,29.6
  Top 0.254: LVL2.P$37 22.66,10.2 v22.88,10.41 | LVL2.P$13 LVL2.P$12 14.07,10.2 | LVL1.P$1 v15.63,48.76 v15.64,48.77 | v13.73,42.93 14.13,43.2 LVL1.P$12 LVL1.P$13 | LVL1.P$25 21.13,37.75 v20.84,37.47 | LVL1.P$37 23.24,43.2 v23.26,43.18 | LVL1.P$24 15.63,37.85 v16.09,37.39 | MAX10.F3 v15.8,27.2 | LVL2.P$25 21.03,5.35 v22.29,4.09 | LVL2.P$24 15.82,5.4 16.25,4.98 17.72,4.98 v18.02,4.67
  Top 0.305: 14.07,10.2 v13.99,10.29 | C7.2 22.88,16.51 v22.7,15.6 | MAX10.N13 23.4,19.7 v23.38,19.68 | LVL2.P$1 15.53,15.64 v15.76,15.88
  Top 0.406: C2.2 4.53,46.16 4.99,45.7 6.29,45.7 6.57,45.41 | 6.57,45.41 6.57,44.59 REG1.2 | 6.57,45.41 6.92,45.77 8.02,45.77 8.02,45.8 8.63,46.41 8.6,46.43 8.6,47.68 8.17,48.11 8.17,49.33 v8.58,49.73 | C3.2 7.75,40.4 8.02,40.13 | 8.02,40.13 v8.37,39.78 | R1.2 1.79,37.27 v1.83,37.31 | C4.2 3.91,40.83 v4.25,40.49 4.61,40.13 C5.2 | C1.1 20.85,50.92 v21.48,50.29 | C6.2 13.15,37.88 v12.99,37.9 | 22.5,3.89 v22.29,4.09 20.38,2.17 C8.1 | 8.02,40.13 | 27.32,8.4 27.44,8.4
  Top 0.61: 27.32,8.4 27.32,41.66 JP5.3 | 27.44,8.4 POW.3
  Bottom 0.254: v15.64,48.77 15.89,49.02 | v13.73,42.93 13.73,42.55 | v16.09,37.39 15.89,37.52 | v20.84,37.47 20.84,37.34 20.72,37.21 | v23.26,43.18 23.51,43.18
  Bottom 0.305: v22.88,10.41 22.75,10.29 | v13.99,10.29 13.86,10.29 13.73,10.41 | v23.38,19.68 23.38,19.43 | v15.76,15.88 15.76,16
  Bottom 0.406: v4.25,40.49 4.25,40.27 4.41,40.12
  Bottom 0.813: 9.79,49.17 v8.58,49.73
  pour Bottom (isolate 0.356, rank 6): 9.62,51.54 30,51.54 30,0.23 8.5,0.23 8.5,12.29 0.45,12.29 0.47,43.56 9.39,37.9 9.39,38.13
  pour Bottom: 0.6,44.35 8.93,38.91 8.83,51.66 0.6,51.54 0.6,51.41 0.63,51.41 0.63,51.38
JTAGEN  (via drill 0.25)
  Top 0.127: MAX10.E5 16.6,28.8 13,28.8 12.21,28.01 12.21,27.3 11.32,26.42 10.3,26.42 9.92,26.04 v9.92,23.62 | JTAG.8 5.87,21.4 6.95,22.48 6.95,24.08 v7,24.13
  Bottom 0.127: v7,24.13 7,23.88 8.4,22.48 9.41,22.48 9.92,22.86 v9.92,23.62
LIN1
  Top 0.127: MAX10.A6 17.8,33.79 18.3,34.29 18.3,46.23 17.73,46.8 LVL1.P$3
LIN2
  Top 0.127: MAX10.B5 17.4,31.2 17.4,33.77 18.05,34.42 18.05,45.85 17.5,46.4 LVL1.P$4
LIN3
  Top 0.127: MAX10.A5 17,33.75 17.8,34.54 17.8,44.83 17.43,45.2 LVL1.P$7
LIN4
  Top 0.127: MAX10.B4 16.6,31.2 16.6,33.73 17.54,34.67 17.54,44.32 17.03,44.83 17,44.8 LVL1.P$8
LIN5
  Top 0.127: MAX10.A4 16.2,33.71 17.29,34.8 17.29,43.18 16.87,43.6 LVL1.P$11
LIN6
  Top 0.127: MAX10.B3 15.8,31.2 15.8,33.69 17.03,34.92 17.03,41.78 16.82,42 LVL1.P$15
LIN7
  Top 0.127: MAX10.A3 15.4,33.8 16.78,35.18 16.78,41.4 16.58,41.6 LVL1.P$16
LIN8  (via drill 0.41)
  Top 0.127: LVL1.P$19 13.24,40.4 v13.1,40.26 | v16.27,36.2 16.27,35.18 15,33.91 15,30.4 MAX10.C2 | MAX10.C2 MAX10.C1 | MAX10.D1 MAX10.C2
  Bottom 0.127: v13.1,40.26 15.26,38.1 15.26,37.08 15.64,36.7 v16.27,36.2
LIN9  (via drill 0.41)
  Top 0.127: LVL1.P$20 13.98,40 v13.22,39.24 | v15.64,35.43 14.6,34.4 MAX10.A2 MAX10.B2
  Bottom 0.127: v15.64,35.43 15.64,36.07 15,36.7 15,37.97 13.73,39.24 v13.22,39.24
LIN10
  Top 0.127: MAX10.B1 14.2,31.2 14.2,32 14.29,32.09 14.29,34.59 15,35.31 15,37.47 14.49,37.97 14.49,38.61 14.69,38.8 LVL1.P$23
LIN11  (via drill 0.41)
  Top 0.127: v13.99,18.54 12.6,19.93 12.6,21.6 MAX10.M1 | v13.48,14.48 13.48,14.35 13.61,14.22 13.99,14.22 14.41,13.8 LVL2.P$3
  Bottom 0.127: v13.99,18.54 13.99,14.99 v13.48,14.48
LIN12  (via drill 0.41)
  Top 0.127: MAX10.M2 14.2,22.4 14.2,19.34 v15,18.54 | 13.99,13.34 v13.86,13.54 13.92,13.4 LVL2.P$4
  Bottom 0.127: v13.86,13.54 13.86,13.97 14.11,14.22 14.11,14.73 14.24,14.86 14.24,17.78 v15,18.54
LIN13  (via drill 0.41)
  Top 0.127: MAX10.N2 14.6,20.21 v16.02,18.8 | LVL2.P$7 13.99,12.2 v13.86,12.06
  Bottom 0.127: v16.02,18.8 16.02,18.67 14.49,17.14 14.49,12.7 v13.86,12.06
LIN14
  Top 0.127: LVL2.P$8 15.5,11.81 16.4,11.81 16.65,12.06 16.65,19.18 15,20.83 15,23.2 MAX10.L3
LIN15
  Top 0.127: LVL2.P$11 15.55,10.54 16.78,10.54 16.91,10.67 16.91,19.43 15.4,20.94 MAX10.N3 MAX10.M3 MAX10.L4
LIN16
  Top 0.127: MAX10.M4 15.8,22.4 15.8,21.05 17.16,19.68 17.16,9.27 16.91,9.02 15.51,9.02 LVL2.P$15
LIN17
  Top 0.127: MAX10.N4 16.2,21.15 17.41,19.94 17.41,8.76 17.25,8.6 LVL2.P$16 15.53,8.64
LIN18
  Top 0.127: MAX10.M5 16.6,22.4 16.6,21.2 17.61,20.19 17.67,20.19 17.67,7.62 17.41,7.37 15.52,7.37 LVL2.P$19
LIN19
  Top 0.127: MAX10.N5 17,21.2 17.04,21.2 17.92,20.32 17.92,7.24 17.67,6.99 15.5,6.99 LVL2.P$20
LIN20
  Top 0.127: MAX10.N6 17.8,20.95 18.18,20.57 18.18,6.22 17.75,5.8 LVL2.P$23
LIN21
  Top 0.127: MAX10.M7 18.2,22.4 18.2,21.06 18.43,20.83 18.43,6.1 18.73,5.8 LVL2.P$26
LIN22
  Top 0.127: MAX10.N7 18.6,21.04 18.68,20.95 18.68,7.49 19.18,7 LVL2.P$29
LIN23
  Top 0.127: MAX10.M8 19,22.4 19,21.02 18.94,20.95 18.94,7.87 19.41,7.4 LVL2.P$30
LIN24
  Top 0.127: MAX10.N8 19.4,21.04 19.19,20.83 19.19,8.89 19.48,8.6 LVL2.P$33
LIN25
  Top 0.127: MAX10.M9 19.8,22.4 19.8,20.8 19.45,20.45 19.45,9.27 19.72,9 LVL2.P$34
LIN26
  Top 0.127: MAX10.N9 20.2,20.57 19.7,20.07 19.7,10.79 19.9,10.6 LVL2.P$38
LIN27
  Top 0.127: MAX10.M10 20.6,22.4 20.6,20.58 19.95,19.94 19.95,11.94 20.09,11.8 LVL2.P$41
LIN28  (via drill 0.41)
  Top 0.127: MAX10.N10 21,20.22 v20.46,19.68 | 22.75,12.19 v23,11.94 22.74,12.2 LVL2.P$42
  Bottom 0.127: v23,11.94 22.74,12.2 22.24,12.2 21.48,12.96 21.48,16 20.46,17.02 v20.46,19.68
LIN29  (via drill 0.41)
  Top 0.127: v20.97,18.92 21.4,19.35 21.4,22.4 MAX10.M11 | LVL2.P$45 23.12,13.4 v23.26,13.54
  Bottom 0.127: v20.97,18.92 20.97,18.54 20.72,18.29 20.72,17.14 21.73,16.13 21.73,13.91 22.24,13.4 | 21.73,13.4 22.24,13.4 | 22.24,13.4 23.12,13.4 v23.26,13.54
LIN30  (via drill 0.41)
  Top 0.127: MAX10.N11 21.8,18.48 v21.61,18.29 | v23.26,14.61 22.45,13.8 LVL2.P$46
  Bottom 0.127: v21.61,18.29 21.48,18.29 20.97,17.78 20.97,17.27 21.99,16.26 21.99,14.18 22.37,13.8 22.45,13.8 v23.26,14.61
LIN31
  Top 0.127: LVL1.P$26 22.07,38.8 22.29,38.58 22.29,37.34 22.11,37.16 22.11,35.56 21.4,34.85 21.4,34.31 22.6,33.12 22.6,32.74 22.5,32.64 22.5,31.7 MAX10.A12
LIN32  (via drill 0.41)
  Top 0.127: MAX10.B11 22.2,31.2 22.2,32.93 20.97,34.16 20.97,35.43 v21.45,35.92 | LVL1.P$29 22.75,40 v23.64,39.12
  Bottom 0.127: v21.45,35.92 21.99,36.5 23.64,38.15 v23.64,39.12
LIN33  (via drill 0.41)
  Top 0.127: MAX10.A11 21.8,32.7 20.59,33.91 v20.59,35.94 | LVL1.P$30 23.24,40.4 v23.51,40.13
  Bottom 0.127: v20.59,35.94 21.23,36.45 23.13,38.35 23.13,39.75 v23.51,40.13
LIN34
  Top 0.127: MAX10.B10 21.4,31.2 21.4,32.46 20.08,33.78 20.08,41.4 20.28,41.6 LVL1.P$33
LIN35
  Top 0.127: MAX10.A10 21,32.48 19.83,33.66 19.83,41.91 19.95,42.04 19.99,42 LVL1.P$34
LIN36
  Top 0.127: MAX10.A9 20.2,32.9 19.57,33.53 19.57,43.43 19.74,43.6 LVL1.P$38
LIN37
  Top 0.127: MAX10.A8 19.4,33.19 19.32,33.27 19.32,44.45 19.67,44.8 LVL1.P$41
LIN38
  Top 0.127: MAX10.B7 19,31.2 19,33.72 19.07,33.78 19.07,44.96 19.32,45.21 19.33,45.2 LVL1.P$42
LIN39
  Top 0.127: MAX10.A7 18.6,33.7 18.81,33.91 18.81,45.97 19.24,46.4 LVL1.P$45
LIN40
  Top 0.127: MAX10.B6 18.2,31.2 18.2,33.68 18.56,34.04 18.56,46.35 19,46.8 LVL1.P$46
LVL1  (via drill 0.41)
  Top 0.178: LVL1.P$2 14.16,47.2 12.28,49.07 v12.16,49.07
  Bottom 0.178: DIGIMAX.1 10.81,50.42 v12.16,49.07
LVL2
  Top 0.178: LVL1.P$5 12.82,46 DIGIMAX.2
LVL3
  Top 0.178: LVL1.P$6 10.95,45.6 DIGIMAX.3
LVL4
  Top 0.178: LVL1.P$9 12.29,44.4 DIGIMAX.4
LVL5
  Top 0.178: LVL1.P$10 13.84,44 11.62,41.78 11.62,41.2 DIGIMAX.5
LVL6
  Top 0.178: DIGIMAX.6 11.8,38.84 11.8,40.89 11.98,41.07 11.98,41.6 12.51,42.14 14.29,42.14 14.55,42.4 LVL1.P$14
LVL7
  Top 0.178: LVL1.P$17 12.64,41.2 12.16,40.72 12.16,38.58 11.8,38.23 11.8,36.3 DIGIMAX.7
LVL8  (via drill 0.25)
  Top 0.178: LVL1.P$18 12.77,40.8 12.51,40.54 12.51,38.41 12.16,38.05 v12.16,35.56
  Bottom 0.178: DIGIMAX.8 10.81,33.88 9.85,34.85 9.85,35.74 10.38,36.27 11.45,36.27 v12.16,35.56
LVL9  (via drill 0.25)
  Top 0.178: LVL1.P$21 14.42,39.6 13.76,38.94 13.76,37.52 14.11,37.16 v14.11,35.74
  Bottom 0.178: v14.11,35.74 13.05,35.74 11.68,34.49 11.68,32.44 10.81,31.55 DIGIMAX.9
LVL10  (via drill 0.25)
  Top 0.178: LVL1.P$22 14.55,39.2 14.11,38.76 14.11,37.87 14.65,37.34 14.65,35.56 13.94,34.85 13.94,32.72 13.76,32.54 13.22,32.54 v11.68,31.77 | v11.75,29.34 DIGIMAX.10
  Bottom 0.178: v11.68,31.77 v11.75,29.34
LVL11
  Top 0.178: DIGIMAX.11 12.16,23.8 12.16,19.91 13.22,18.85 13.22,15.65 14.11,14.76 14.11,14.58 14.49,14.2 LVL2.P$2
LVL12
  Top 0.178: LVL2.P$5 13.56,13 12.87,13.69 12.87,18.67 11.8,19.74 11.8,21.61 DIGIMAX.12
LVL13
  Top 0.178: LVL2.P$6 12.89,12.6 12.51,12.98 12.51,17.78 11.45,18.85 11.45,19.43 DIGIMAX.13
LVL14
  Top 0.178: LVL2.P$9 13.2,11.4 12.16,12.45 12.16,16.18 DIGIMAX.14
LVL15
  Top 0.178: LVL2.P$10 12.89,11 11.8,12.09 11.8,13.99 DIGIMAX.15
LVL16
  Top 0.178: LVL2.P$14 13.86,9.4 DIGIMAX.16
LVL17
  Top 0.178: LVL2.P$17 12.52,8.2 DIGIMAX.17
LVL18
  Top 0.178: LVL2.P$18 11.24,7.8 DIGIMAX.18
LVL19
  Top 0.178: LVL2.P$21 12.59,6.6 DIGIMAX.19
LVL20
  Top 0.178: LVL2.P$22 12.85,6.2 12.16,5.51 12.16,3.63 DIGIMAX.20
LVL21
  Top 0.178: LVL2.P$27 22.14,6.2 DIGIMAX.21
LVL22
  Top 0.178: LVL2.P$28 24.28,6.6 DIGIMAX.22
LVL23
  Top 0.178: LVL2.P$31 25.62,7.8 DIGIMAX.23
LVL24
  Top 0.178: LVL2.P$32 24.34,8.2 DIGIMAX.24
LVL25
  Top 0.178: LVL2.P$35 22.32,9.4 23,8.71 24.07,8.71 24.96,9.6 24.96,10.67 25.85,11.56 25.85,12.24 DIGIMAX.25
LVL26
  Top 0.178: LVL2.P$39 24.05,11 24.96,11.91 24.96,13.89 DIGIMAX.26
LVL27
  Top 0.178: LVL2.P$40 23.91,11.4 24.6,12.09 24.6,14.22 24.96,14.58 24.96,16.43 DIGIMAX.27
LVL28
  Top 0.178: LVL2.P$43 23.87,12.6 24.25,12.98 24.25,14.4 24.6,14.76 24.6,18.62 DIGIMAX.28
LVL29
  Top 0.178: DIGIMAX.29 26.05,21.72 25.14,20.8 25.14,19.74 24.25,18.85 24.25,14.94 23.89,14.58 23.89,13.16 23.73,13 LVL2.P$44
LVL30
  Top 0.178: DIGIMAX.30 24.78,23.88 24.78,19.91 23.89,19.02 23.89,16 22.09,14.2 LVL2.P$47
LVL31
  Top 0.178: LVL1.P$27 22.21,39.2 23.89,37.52 23.89,35.92 24.43,35.38 24.43,34.49 24.78,34.14 24.78,29.87 25.85,28.8 25.85,27.89 DIGIMAX.31
LVL32
  Top 0.178: DIGIMAX.32 25.14,31.14 25.14,34.31 24.78,34.67 24.78,35.56 24.25,36.09 24.25,37.69 22.34,39.6 LVL1.P$28
LVL33
  Top 0.178: DIGIMAX.33 25.85,32.97 25.85,34.14 25.14,34.85 25.14,35.74 24.6,36.27 24.6,38.41 24.25,38.76 24.25,40.54 23.99,40.8 LVL1.P$31
LVL34
  Top 0.178: DIGIMAX.34 24.96,36.4 24.96,38.58 24.6,38.94 24.6,40.72 24.12,41.2 LVL1.P$32
LVL35
  Top 0.178: DIGIMAX.35 25.31,38.58 25.31,39.29 24.96,39.65 24.96,40.89 24.25,41.6 22.65,41.6 22.29,41.96 22.29,42.32 22.21,42.4 LVL1.P$35
LVL36
  Top 0.178: DIGIMAX.36 26.05,41.05 24.96,42.14 24.96,43.2 24.51,43.65 24.25,43.92 24.16,44 LVL1.P$39
LVL37
  Top 0.178: LVL1.P$40 24.58,44.4 DIGIMAX.37
LVL38
  Top 0.178: LVL1.P$43 25.92,45.6 DIGIMAX.38
LVL39
  Top 0.178: LVL1.P$44 24.05,46 DIGIMAX.39
LVL40
  Top 0.178: LVL1.P$47 22.7,47.2 DIGIMAX.40
N$1  (via drill 0.25)
  Top 0.127: MAX10.K12 v23,24.8
  Bottom 0.127: v23,24.8 24.6,24.8 25.4,24 27,24 JP2.2
N$2  (via drill 0.25)
  Top 0.127: MAX10.N12 v22.6,21.2
  Bottom 0.127: v22.6,21.2 23,21.2 24.2,20 24.2,19.2 25,18.4 25,16.8 25.8,16 26.6,16 27,15.6 27,13.86 JP1.3
N$3  (via drill 0.25)
  Top 0.127: MAX10.M13 v24.2,22
  Bottom 0.127: v24.2,22 24.2,21.6 25,20.8 25,19.6 25.8,18.8 26.2,18.8 27,18 27,16.4 JP1.2
N$4  (via drill 0.25)
  Top 0.127: MAX10.K13 24.04,24.4 24.4,24.77 24.4,25.8 v25,26.4
  Bottom 0.127: JP2.1 28.36,25.04 27.4,26 27,26.4 v25,26.4
N$5  (via drill 0.25)
  Top 0.127: MAX10.L12 v23,24
  Bottom 0.127: v23,24 25,24 25.4,23.6 26.6,23.6 27.4,22.8 27.4,21.06 JP2.3
N$6  (via drill 0.25)
  Top 0.127: MAX10.L13 23.8,23.6 v24.2,23.2
  Bottom 0.127: v24.2,23.2 24.2,22.8 25.8,21.2 26.2,21.2 27,20.4 27,18.94 JP1.1
N$8  (via drill 0.25)
  Top 0.127: MAX10.D13 v24.2,28.4
  Bottom 0.127: JP3.3 27.66,28.4 27.62,28.4 27.45,28.57 24.38,28.57 v24.2,28.4
N$9  (via drill 0.25)
  Top 0.127: MAX10.C13 v24.2,30
  Bottom 0.127: v24.2,30 25.8,31.6 27.46,31.6 JP3.1
N$10  (via drill 0.25)
  Top 0.127: MAX10.D12 v23,29.6
  Bottom 0.127: v23,29.6 23.8,29.6 24.2,29.2 27.6,29.2 JP3.2
N$11  (via drill 0.25)
  Top 0.127: MAX10.C12 v23,30.4
  Bottom 0.127: v23,30.4 23.8,30.4 24.6,31.2 24.6,33.6 25,34 27.34,34 JP4.3
N$15  (via drill 0.25)
  Top 0.127: MAX10.B13 v23.8,31.2
  Bottom 0.127: v23.8,31.2 24.2,31.6 24.2,35.6 25,36.4 27.2,36.4 JP4.2
N$16  (via drill 0.25)
  Top 0.127: MAX10.B12 v23,31.2
  Bottom 0.127: v23,31.2 23.8,32 23.8,36.8 25.8,38.8 27.06,38.8 JP4.1
N$137
  Top 0.406: REG1.5 5.53,46.92 4.44,48.01 4.44,49.13 L1.1
NSTATUS  (via drill 0.25)
  Top 0.127: RN2.7 7.44,35.94 8.25,35.94 8.53,35.71 8.53,33.71 8.17,33.35 v8.09,33.02 | v8.17,30.73 10.05,30.73 10.43,31.11 11.19,31.11 11.91,30.4 v13,30.4 | MAX10.C4 v15.8,29.6
  Bottom 0.127: v8.09,33.02 v8.17,30.73 | v15.8,29.6 15,30.4 v13,30.4
TCK  (via drill 0.25)
  Top 0.127: MAX10.G2 14.2,26.4 13,26.4 12.51,25.91 v11.95,25.91
  Top 0.203: JTAG.1 1.79,29.37 R1.1
  Bottom 0.127: JTAG.1 3.33,27.81 4.97,26.11 4.97,24.5 5.41,24.12 6.07,24.12 6.19,24 | 8.53,21.79 11.17,21.79 12.34,22.96 12.34,25.53 v11.95,25.91
  Bottom 0.152: 8.53,21.79 8.37,21.82 6.19,24
TDI  (via drill 0.25)
  Top 0.127: MAX10.F5 16.6,28 13.04,28 v12.97,28.07
  Top 0.203: RN2.6 7.92,35.23 8.22,34.98 8.22,33.96 4.95,30.69 4.95,19.89 3.33,18.27 JTAG.9
  Bottom 0.127: 8.14,21.18 8.17,21.21 11.32,21.18 12.84,22.71 12.84,27.94 v12.97,28.07
  Bottom 0.203: 8.14,21.18 6.09,19.13 4.78,19.13 JTAG.9
TDO  (via drill 0.25)
  Top 0.127: MAX10.F6 v17.4,27.2
  Bottom 0.127: 8.47,20.9 11.52,20.9 13.1,22.48 13.1,26.95 14.15,28 16.6,28 v17.4,27.2
  Bottom 0.152: 6.32,18.75 8.47,20.9
  Bottom 0.203: JTAG.3 1.92,23.89 1.92,17.22 2.68,16.46 3.75,16.46 4.54,17.25 4.54,17.96 5.33,18.75 6.32,18.75
TMS  (via drill 0.25)
  Top 0.127: MAX10.G1 13,26.8 12.87,26.67 v12.34,26.67
  Top 0.203: JTAG.5 3.33,23.8 4.26,24.71 4.26,31.14 RN2.5
  Bottom 0.127: 8.37,21.49 11.24,21.49 12.59,22.84 12.59,26.54 v12.34,26.67
  Bottom 0.152: 8.37,21.49 4.52,21.51 4.24,21.79
  Bottom 0.203: 4.24,21.79 JTAG.5

### Text on the board
tPlace: 3V3 | GND
tNames: A0 | S0 | P0 | G5 | S5 | G0 | GND | S0 | P5 | A5 | 5V